# Altium schematic sheet 8x3.SchDoc
size A4
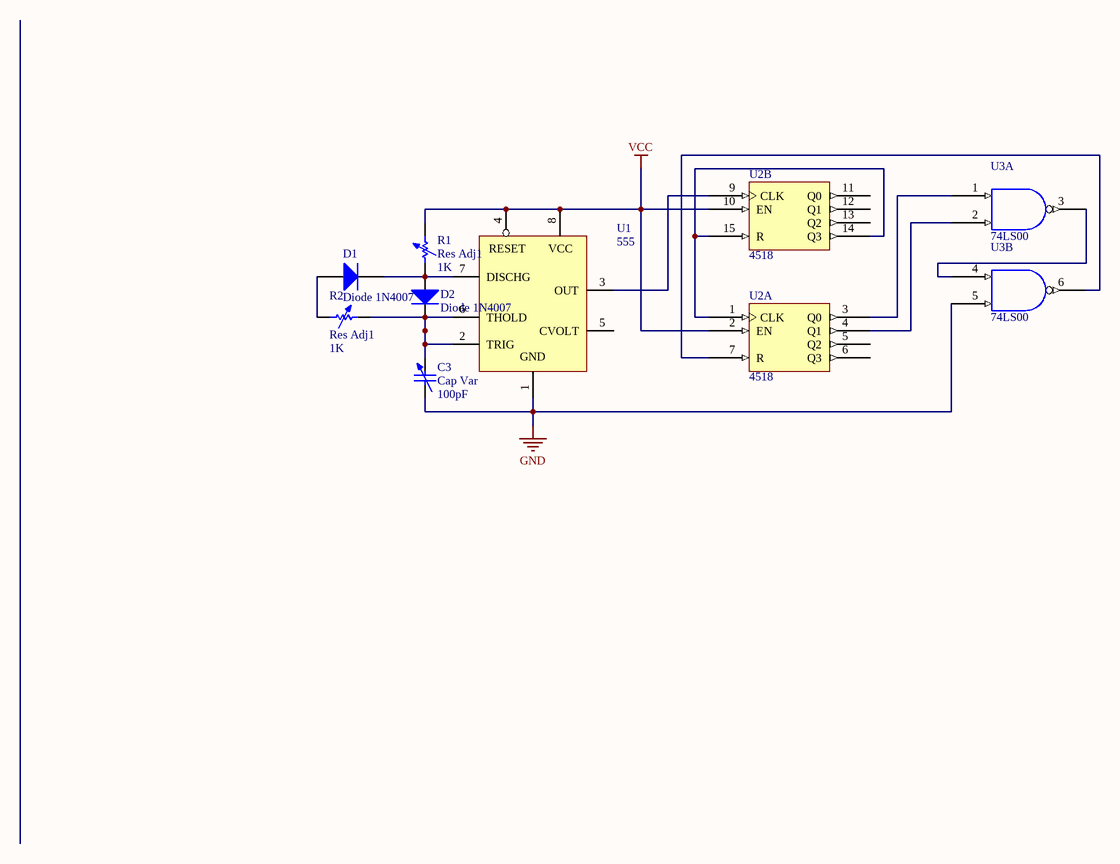
[diagram p0: 8x3.SchDoc]

## Parts
C3  Cap Var  value 100pF  [C1210_N]
D1  Diode 1N4007  [DO-41]
D2  Diode 1N4007  [DO-41]
R1  Res Adj1  value 1K  [AXIAL-0.7]
R2  Res Adj1  value 1K  [AXIAL-0.7]
U1  555
U2  4518  [DIP-16]  (parts A,B of 2)
U3  74LS00  [DIP-14]  (parts A,B of 4)

## Nets
GND: C3.1 U1.1(GND) U2.8(GND) U3.5 U3.7(GND)
VCC: R1.2 U1.4(RESET) U1.8(VCC) U2.2(EN) U2.10(EN) U2.16(VCC) U3.14(VCC)
NetC3_2: C3.2 D2.2(K) R2.2 U1.2(TRIG) U1.6(THOLD)
NetD1_1: D1.1(A) R2.1
NetD1_2: D1.2(K) R1.1 U1.7(DISCHG)
NetU1_3: U1.3(OUT) U2.9(CLK)
NetU2_1: U2.1(CLK) U2.14(Q3) U2.15(R)
NetU2_3: U2.3(Q0) U3.1
NetU2_4: U2.4(Q1) U3.2
NetU2_7: U2.7(R) U3.6
NetU3_3: U3.3 U3.4

Not connected (* = marked no-connect by the designer): D2 1(A); U1 5(CVOLT); U2 5(Q2) 6(Q3) 11(Q0) 12(Q1) 13(Q2)

## Library data of the parts
C3 = Cap Var: Variable or Adjustable Capacitor; Published: 24-Mar-1999; LatestRevisionDate: 29-May-2009; LatestRevisionNote: IPC-7351 Footprint Added.; PackageReference: C1210; Publisher: Altium Limited; PackageDescription: Chip Capacitor 1210 Case Size; Code_JEITA: 1210; Code_IPC: CAPC3225
D1 D2 = Diode 1N4007: 1 Amp General Purpose Rectifier; Published: 8-Jun-2000; LatestRevisionDate: 17-Jul-2002; LatestRevisionNote: Re-released for DXP Platform.; DatasheetVersion: 1998; PackageVersion: Aug-1999; PackageReference: DO-41; Publisher: Altium Limited; PackageDescription: Diode, Axial; Body 5.2 x 2.7 mm (LxDia. max), Lead Dia. 0.86 mm (max); Code_JEDEC: DO-204-AL; ComponentLink1Description: Manufacturer Link; ComponentLink1URL: http://www.fairchildsemi.com/; ComponentLink2Description: Datasheet; ComponentLink2URL: http://www.fairchildsemi.com/ds/1N%2F1N4001.pdf
R1 R2 = Res Adj1: Variable Resistor; Set Position: 0.5; Published: 8-Jun-2000; LatestRevisionDate: 17-Jul-2002; LatestRevisionNote: Re-released for DXP Platform.; PackageReference: AXIAL-0.7; Publisher: Altium Limited; PackageDescription: Axial Device, Thru-Hole; 2 Leads; 0.7 in Pin Spacing
U1 = 555: Timer